# EAGLE design PA (EAGLE 7.1.0)
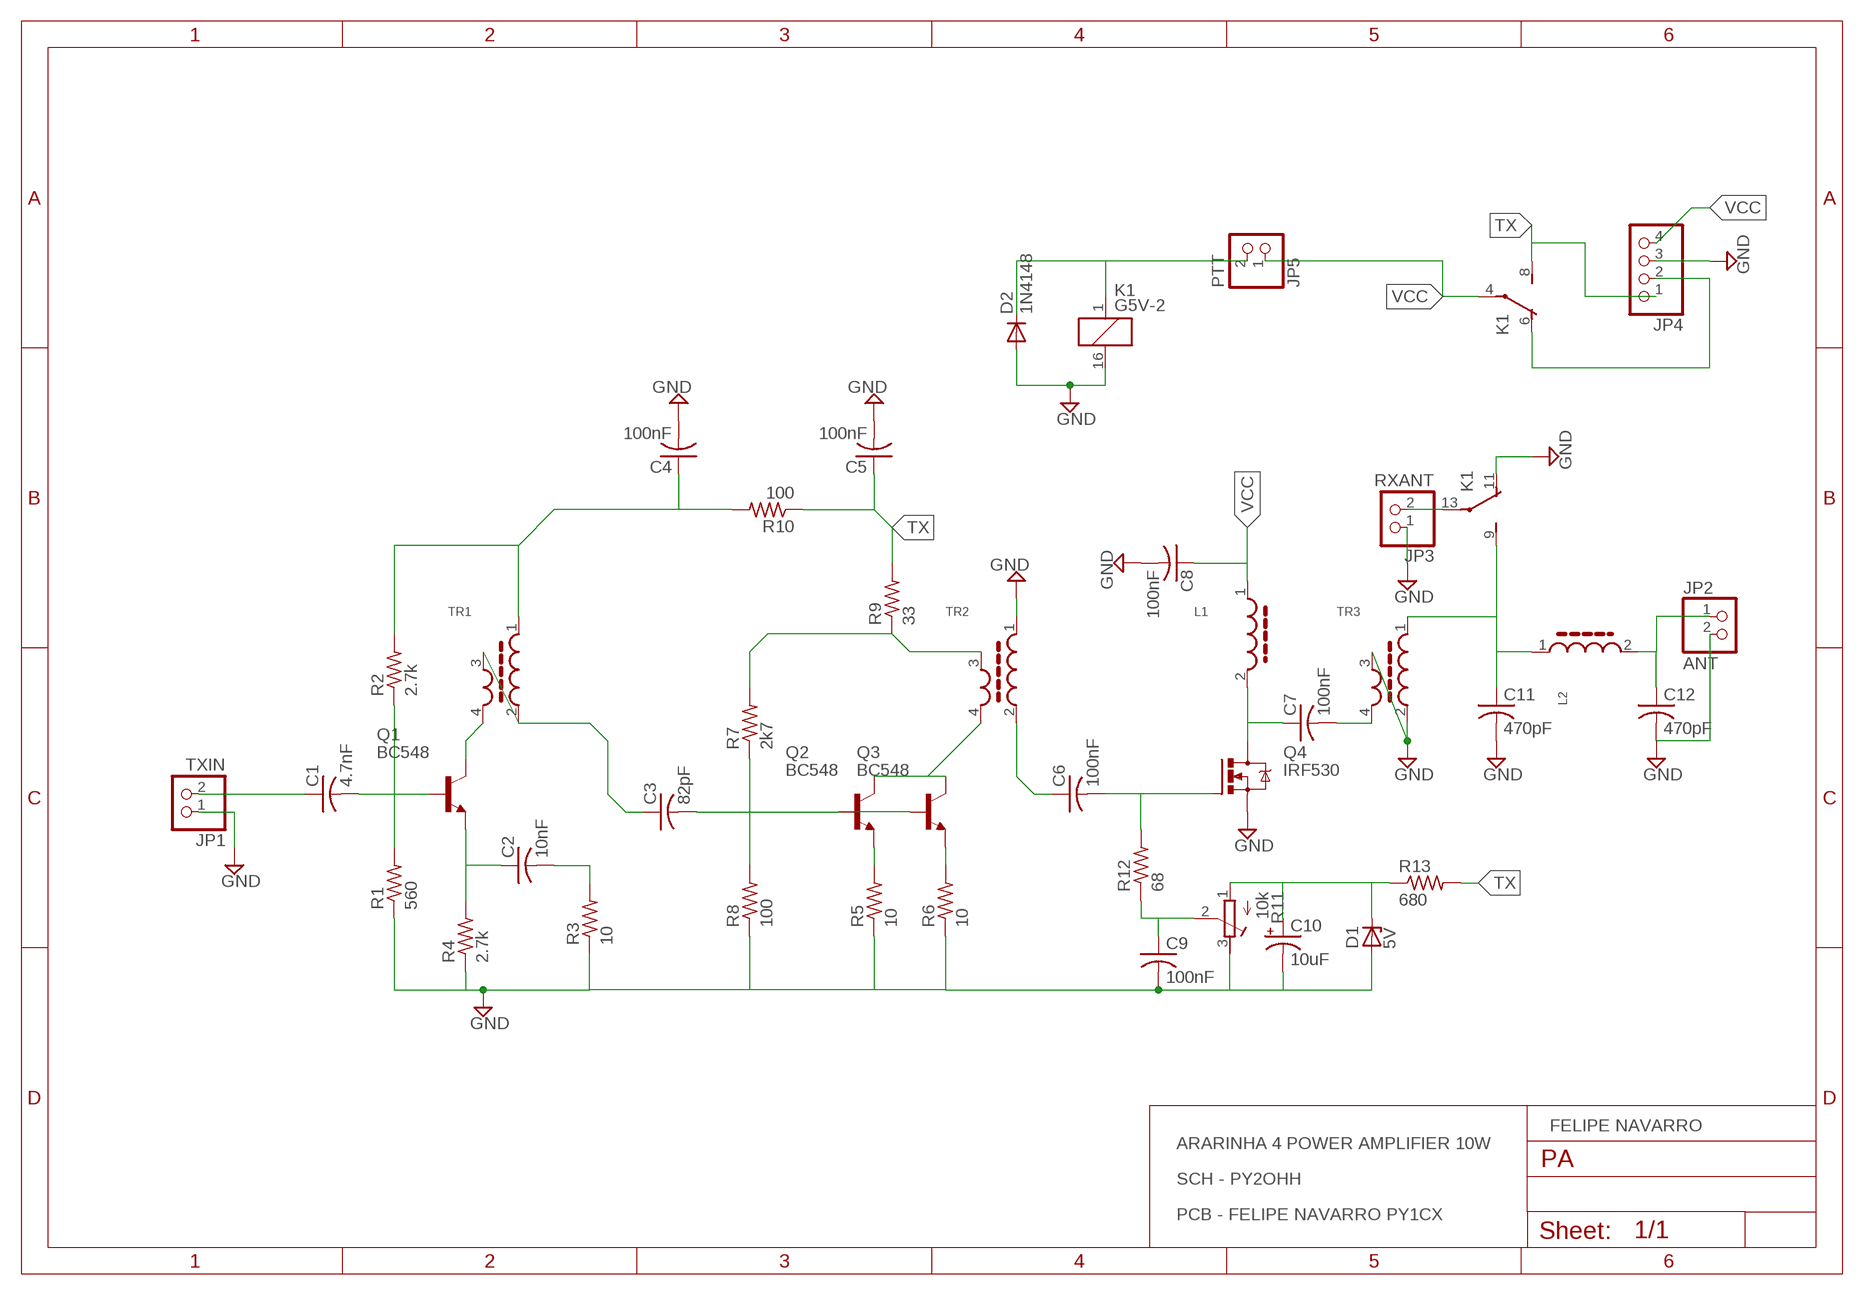
[diagram p0: schematic, sheet 1]

## Parts
C1  4.7nF  C-US050-030X075  [C050-030X075]
C2  10nF  C-US050-030X075  [C050-030X075]
C3  82pF  C-US050-030X075  [C050-030X075]
C4  100nF  C-US050-030X075  [C050-030X075]
C5  100nF  C-US050-030X075  [C050-030X075]
C6  100nF  C-US050-030X075  [C050-030X075]
C7  100nF  C-US050-030X075  [C050-030X075]
C8  100nF  C-US050-030X075  [C050-030X075]
C9  100nF  C-US050-030X075  [C050-030X075]
C10  10uF  CPOL-USE3.5-8  [E3,5-8]
C11  470pF  C-US050-030X075  [C050-030X075]
C12  470pF  C-US050-030X075  [C050-030X075]
D1  5V  ZTE  [DO35Z10]
D2  1N4148  1N4148DO35-7  [DO35-7]
JP1  TXIN  PINHD-1X2  [1X02]
JP2  ANT  PINHD-1X2  [1X02]
JP3  RXANT  PINHD-1X2  [1X02]
JP4  PINHD-1X4  [1X04]
JP5  PTT  PINHD-1X2  [1X02]
K1  G5V-2  [G5V-2]
L1  TOROID-T37-2PIN  [TOROID-T37-2PIN]
L2  TOROID-T37-2PIN  [TOROID-T37-2PIN]
Q1  BC548  [TO92-EBC]
Q2  BC548  [TO92-EBC]
Q3  BC548  [TO92-EBC]
Q4  IRF530  [TO220BV]
R1  560  R-US_0204/7  [0204/7]
R2  2.7k  R-US_0204/7  [0204/7]
R3  10  R-US_0204/7  [0204/7]
R4  2.7k  R-US_0204/7  [0204/7]
R5  10  R-US_0204/7  [0204/7]
R6  10  R-US_0204/7  [0204/7]
R7  2k7  R-US_0204/7  [0204/7]
R8  100  R-US_0204/7  [0204/7]
R9  33  R-US_0204/7  [0204/7]
R10  100  R-US_0204/7  [0204/7]
R11  10k  R-TRIMM64W  [RTRIM64W]
R12  68  R-US_0204/7  [0204/7]
R13  680  R-US_0204/7  [0204/7]
TR1  TOROID-T37-4PIN  [TOROID-T37-4PIN]
TR2  TOROID-T37-4PIN  [TOROID-T37-4PIN]
TR3  TOROID-T37-4PIN  [TOROID-T37-4PIN]

## Nets
GND: C4.2 C5.2 C8.2 C9.2 C10.- C11.2 C12.2 D1.A D2.A JP1.1 JP2.2 JP3.1 JP4.3 K1.11(2:O) K1.16 Q4.S R1.1 R3.1 R4.1 R5.1 R6.1 R8.1 R11.3(A) TR2.1 TR3.2 TR3.3
N$1: C1.2 Q1.B R1.2 R2.1
N$2: C2.2 R3.2
N$3: C4.1 R2.2 R10.2 TR1.1
N$4: C1.1 JP1.2
N$5: C2.1 Q1.E R4.2
N$6: C3.1 TR1.2 TR1.3
N$7: Q1.C TR1.4
N$8: Q2.E R5.2
N$9: Q3.E R6.2
N$10: Q2.C Q3.C TR2.4
N$11: R7.2 R9.1 TR2.3
N$12: C3.2 Q2.B Q3.B R7.1 R8.2
N$13: C9.1 R11.2(S) R12.1
N$14: C10.+ D1.C R11.1(E) R13.1
N$15: JP3.2 K1.13(2:P)
N$16: C6.1 TR2.2
N$17: C6.2 Q4.G R12.2
N$18: C7.1 L1.2 Q4.D
N$19: C7.2 TR3.4
N$20: C12.1 JP2.1 L2.2
N$21: C11.1 K1.9(2:S) L2.1 TR3.1
N$22: JP4.2 K1.6(1:O)
N$23: D2.C JP5.2 K1.1
TX: C5.1 JP4.1 K1.8(1:S) R9.2 R10.1 R13.2
VCC: C8.1 JP4.4 JP5.1 K1.4(1:P) L1.1

## Notes on the sheet
- FELIPE NAVARRO
- ARARINHA 4 POWER AMPLIFIER 10W
- SCH - PY2OHH
- PCB - FELIPE NAVARRO PY1CX

## Library data of the parts
C1-C9 C11 C12 = resistor:C-US: CAPACITOR, American symbol
C10 = resistor:CPOL-US: POLARIZED CAPACITOR, American symbol
D1 = diode:ZTE: Z DIODE 300 mW
D2 = diode:1N4148: DIODE high speed (Philips)
JP1-JP3 JP5 = pinhead:PINHD-1X2: PIN HEADER
JP4 = pinhead:PINHD-1X4: PIN HEADER
K1 = relay:G5V-2: OMRON PCB Relay Source: http://www.omron.com/ecb/products/pdf/en-g5v2.pdf; MPN: G5V-2 5DC; OC_FARNELL: 9949488; OC_NEWARK: 78K5703
L1 L2 = Toroid_T37:TOROID-T37-2PIN: Toroidal inductor of size T37 (9.53 x 5.21 x 3.25mm). Outward shape corresponds to one layer winding with the wire of diameter 0.4mm.
Q1-Q3 = transistor-npn:BC548*: NPN Transistor
Q4 = transistor-power:IRF530: HEXFET Power MOSFET
R1-R10 R12 R13 = resistor:R-US_: RESISTOR, American symbol
R11 = resistor:R-TRIMM: Trimm resistor
TR1-TR3 = Toroid_T37:TOROID-T37-4PIN: Toroidal trafo of size T37 (9.53 x 5.21 x 3.25). Outward shape corresponds to one layer winding with wire of diameter 0.4mm.

## Board
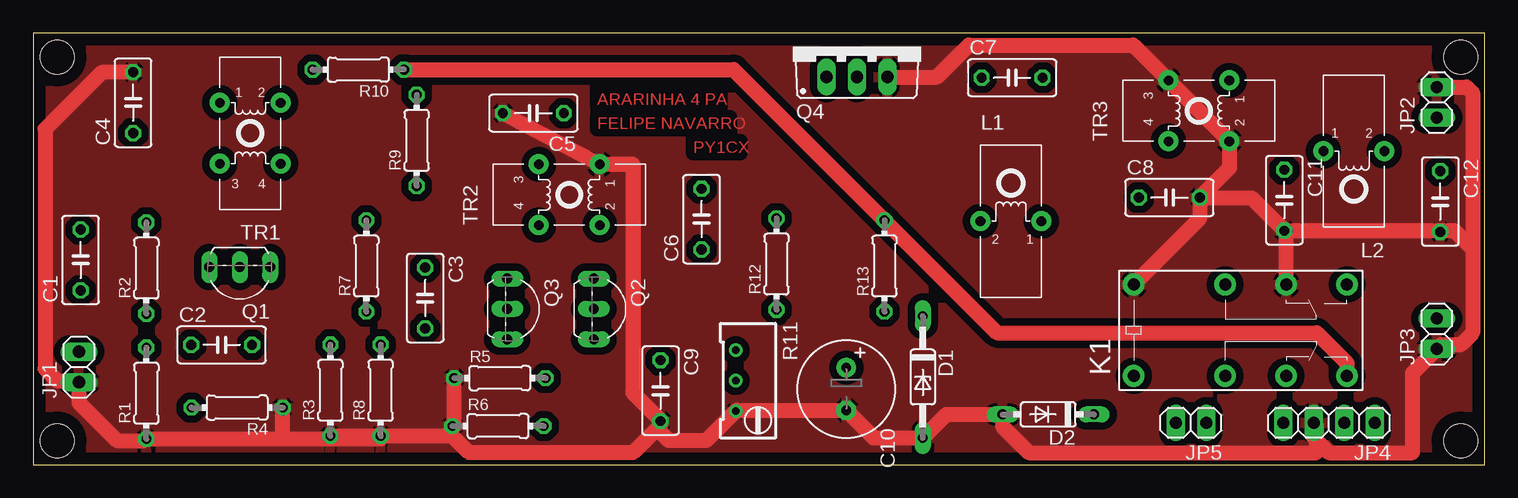
[diagram p1: board, top side]
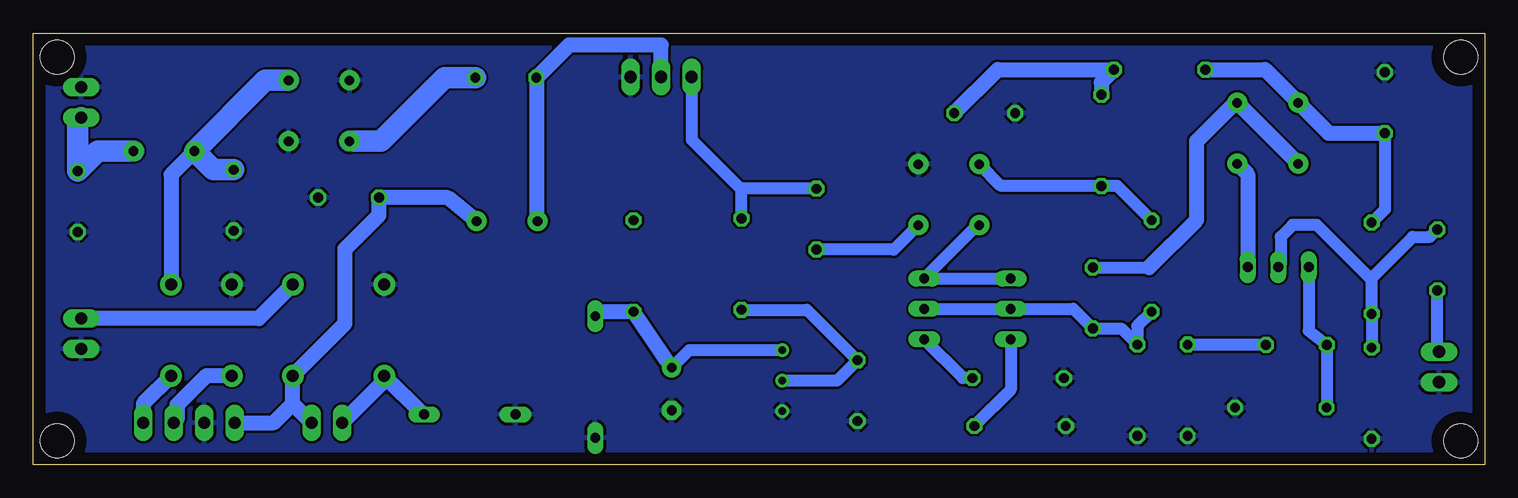
[diagram p2: board, bottom side, seen from below]

Size 121 x 36 mm. Coordinates in mm from the lower left corner, seen from the top.
Outline: 0,0 121,0 121,36 0,36 0,0
Copper layers (1*16): Top 0.035mm / dielectric 1.5mm / Bottom 0.035mm
Design rules "default": minimum track width 10mil, minimum drill 24mil, track to track 8mil, track to pad 8mil, pad to pad 8mil, via to via 8mil, smd to smd 8mil, copper to edge 40mil, drill to drill 8mil, minimum pad ring 10mil, minimum via ring 8mil, stop-mask expansion 4mil, vias tented up to drill 0mil, thermal gap 10mil
Holes 2.8 mm at 2,2 2,34 119,34 119,2

### Footprints (pad centres in the part's own frame; a part is rotated, then mirrored left to right if it is on the bottom)
C050-030X075 = drill 0.813 octagon: 1 -2.54,0; 2 2.54,0
E3,5-8 = drill 0.813 pad 1.6: + -1.778,0 | drill 0.813 pad 1.6 octagon: - 1.778,0
DO35Z10 = drill 0.813 long: A 5.08,0; C -5.08,0
DO35-7 = drill 0.813 long: A 3.81,0; C -3.81,0
1X02 = drill 1.016 long: 1 -1.27,0; 2 1.27,0
1X04 = drill 1.016 long: 1 -3.81,0; 2 -1.27,0; 3 1.27,0; 4 3.81,0
G5V-2 = drill 1 pad 1.8: 1 -8.89,-3.81; 4 -1.27,-3.81; 6 3.81,-3.81; 8 8.89,-3.81; 9 8.89,3.81; 11 3.81,3.81; 13 -1.27,3.81; 16 -8.89,3.81
TOROID-T37-2PIN = drill 0.8 pad 1.676: 1 0,2.54; 2 0,-2.54
TO92-EBC = drill 0.813 long: B 0,-1.27; C -2.54,-1.27; E 2.54,-1.27
TO220BV = drill 1.016 long: D 0,-2.54; G -2.54,-2.54; S 2.54,-2.54
0204/7 = drill 0.813 octagon: 1 -3.81,0; 2 3.81,0
RTRIM64W = drill 0.61: 1 1.27,-2.54; 2 1.27,0; 3 1.27,2.54
TOROID-T37-4PIN = drill 0.8 pad 1.676: 1 2.54,2.54; 2 2.54,-2.54; 3 -2.54,2.54; 4 -2.54,-2.54

### Placement (x,y rotation side)
C1  3.95,17.08 90 top
C2  15.7,10 0 top
C3  32.67,13.91 270 top
C4  8.33,30.2 90 top
C5  41.69,29.33 180 top
C6  55.71,20.49 90 top
C7  81.6,32.29 0 top
C8  94.71,22.29 0 top
C9  52.29,6.18 270 top
C10  67.78,6.32 270 top
C11  104.29,22.07 270 top
C12  117.29,21.96 270 top
D1  74.15,7.32 270 top
D2  84.61,4.2 180 top
JP1  3.81,8.16 90 top
JP2  117,30.23 90 top
JP3  117,10.93 90 top
JP4  108.02,3.5 180 top
JP5  96.51,3.5 180 top
K1  100.63,11.23 0 top
L1  81.5,20.32 270 top
L2  110.09,26.17 90 top
Q1  17.21,15.22 180 top
Q2  48,13 270 top
Q3  40.78,13 270 top
Q4  68.66,34.89 0 top
R1  9.43,5.97 90 top
R2  9.43,16.4 90 top
R3  24.77,6.22 90 top
R4  17,4.77 180 top
R5  38.9,7.23 0 top
R6  38.74,3.23 0 top
R7  27.77,16.58 90 top
R8  28.96,6.22 90 top
R9  31.96,27.06 90 top
R10  27.1,32.96 180 top
R11  59.83,7.01 180 top
R12  61.96,16.74 90 top
R13  70.96,16.58 90 top
TR1  18.09,27.66 90 top
TR2  44.68,22.53 0 top
TR3  97.17,29.53 0 top

### Tracks (layer width: path | path; a pad name or v marks a point on that pad's centre or on a via)
GND
  Top 1.27: 20.81,2.16 R1.1 9.27,2 7,2 3.81,5.19 JP1.1 3.7,7 2,7 1,8 1,28 5.74,32.74 C4.2 | 20.81,2.16 R4.1 | 20.81,2.16 28.96,2.16 R8.1 | R3.1 R8.1 | R8.1 34.93,2.41 | 34.93,2.41 R6.1 35.09,3.23 R5.1 | C9.2 52.29,2.71 53,2 56.09,2 R11.3 58.63,4.54 C10.- 70.08,2.24 D1.A 76.11,4.2 D2.A 80.8,3.2 83,1 107,1 107,3.25 JP4.3 106.75,2.25 108,1 115,1 115,7.66 JP3.1 117.34,10 119,10 120,11 120,18 | C8.2 99.71,24.75 TR3.2 TR3.3 91.7,35 78,35 75.35,32.35 Q4.S | C8.2 97.25,20.55 K1.16 | C8.2 101.53,22.29 C11.2 | C11.2 117.18,19.53 | 117.18,19.53 C12.2 | K1.11 104.44,19.38 C11.2 | 117.18,19.53 118.47,19.53 120,18 | JP2.2 119.5,31.5 120,31 120,18 | C5.2 TR2.1 50,25.07 50,6 52.29,3.71 C9.2 | C9.2 52.29,3.29 50,1 36.34,1 34.93,2.41
  pour Top (isolate 0.61): 0,36 0,0 121,0 121,36
  pour Bottom: 0,36 121,36 121,0 0,0
N$1
  Bottom 1.016: R2.1 R1.2 | R2.1 9.43,15.43 14,20 16,20 17,19 17,16.7 Q1.B | R2.1 9.43,15.57 6,19 4.57,19 C1.2
N$2
  Bottom 1.016: C2.2 24.74,10 R3.2
N$3
  Bottom 1.016: C4.1 8.33,21.31 R2.2
  Bottom 1.27: C4.1 13.01,27.66 TR1.1 18.31,32.96 R10.2
N$4
  Bottom 1.016: JP1.2 3.95,9.43 C1.1
N$5
  Bottom 1.016: R4.2 13.16,4.8 C2.1 14.67,11.18 Q1.E
N$6
  Bottom 1.016: C3.1 27.98,16.45
  Bottom 1.27: TR1.3 TR1.2 20.8,30.2 24,27 24,20.43 27.98,16.45
N$7
  Bottom 1.27: TR1.4 19.75,24.24 Q1.C
N$8
  Bottom 1.016: R5.2 43.5,7.23 Q2.E
N$9
  Bottom 1.016: Q3.E 39.51,6.27 R6.2
N$10
  Bottom 1.016: TR2.4 42.28,19.99 Q2.C Q3.C
N$11
  Bottom 1.016: R7.2 30.63,23.25 R9.1 40.32,23.25 TR2.3
N$12
  Bottom 1.016: R7.1 28.96,11.58 R8.2 30.3,11.37 C3.2 34.3,13 Q3.B Q2.B
N$13
  Bottom 1.016: R12.1 56.5,12.93 C9.1 54,7.01 R11.2
N$14
  Bottom 1.016: R11.1 66.33,9.55 C10.+ | D1.C 74.15,12.58
  Bottom 1.27: D1.C arc90 73.78,12.77 R13.1 C10.+
N$15
  Bottom 1.27: K1.13 102.2,12.2 JP3.2
N$16
  Bottom 1.016: TR2.2 49.26,17.95 C6.1
N$17
  Bottom 1.016: C6.2 62.03,23.03 | 62.03,23.03 66.12,27.12 Q4.G | R12.2 61.96,22.96 62.03,23.03
N$18
  Bottom 1.27: Q4.D 68.66,35 76.35,35 C7.1 79.06,20.42 L1.2
N$19
  Bottom 1.778: C7.2 86.71,32.29 92,27 TR3.4
N$20
  Bottom 1.778: L2.2 115.62,26.17 C12.1 117.29,28.67 JP2.1
N$21
  Bottom 1.27: L2.1 109.52,24.2 K1.9
  Bottom 1.778: TR3.1 101.65,32.07 L2.1 105.99,24.61 C11.1
N$22
  Bottom 1.27: K1.6 106.58,7.42 109,5 109,3.79 JP4.2
N$23
  Bottom 1.27: D2.C 88.52,4.2 K1.1 91.74,7 JP5.2
TX
  Top 1.27: R10.1 58.39,32.96 R13.2 80.35,11 107,11 109.52,8.48 K1.8
  Bottom 1.27: K1.8 111.83,5.11 JP4.1 | R9.2 31.96,31.91 R10.1 40.6,32.96 C5.1
VCC
  Bottom 1.27: JP5.1 99.36,5.08 | 99.36,5.08 K1.4 95,11.78 95,18 92.17,20.83 C8.1 86.42,22.29 L1.1 | JP4.4 100.94,3.5 99.36,5.08

### Text on the board
Top: ARARINHA 4 PA | FELIPE NAVARRO | PY1CX